# EAGLE schematic NFC_Demo_Board (EAGLE 9.2.2)
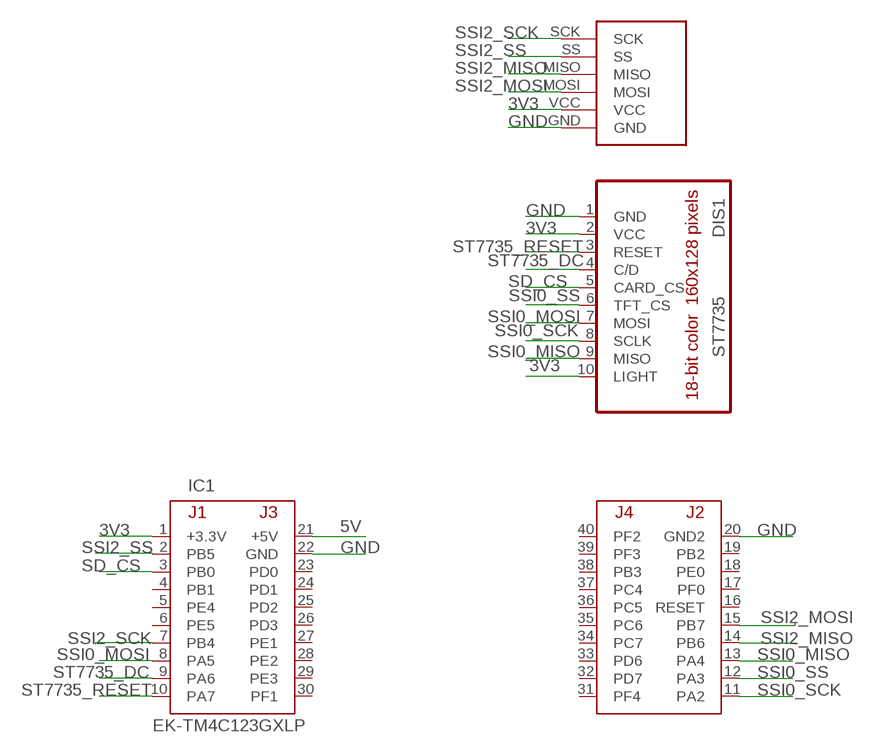
[diagram p0: schematic, sheet 1]

## Parts
DIS1  ST7735  [ST7735]
IC1  EK-TM4C123GXLP  [TM4C123LAUNCHPAD]
U$1  ELECHOUSE_PN532_SPI  [ELECHOUSE_PN532_SPI]

## Nets
3V3: DIS1.2(VCC) DIS1.10(LIGHT) IC1.1(+3.3V) U$1.VCC
5V: IC1.21(+5V)
GND: DIS1.1(GND) IC1.20(GND2) IC1.22(GND) U$1.GND
SD_CS: DIS1.5(CARD_CS) IC1.3(PB0)
SSI0_MISO: DIS1.9(MISO) IC1.13(PA4)
SSI0_MOSI: DIS1.7(MOSI) IC1.8(PA5)
SSI0_SCK: DIS1.8(SCLK) IC1.11(PA2)
SSI0_SS: DIS1.6(TFT_CS) IC1.12(PA3)
SSI2_MISO: IC1.14(PB6) U$1.MISO
SSI2_MOSI: IC1.15(PB7) U$1.MOSI
SSI2_SCK: IC1.7(PB4) U$1.SCK
SSI2_SS: IC1.2(PB5) U$1.SS
ST7735_DC: DIS1.4(C/D) IC1.9(PA6)
ST7735_RESET: DIS1.3(RESET) IC1.10(PA7)
Unconnected: IC1.4(PB1) IC1.5(PE4) IC1.6(PE5) IC1.16(RESET) IC1.17(PF0) IC1.18(PE0) IC1.19(PB2) IC1.23(PD0) IC1.24(PD1) IC1.25(PD2) IC1.26(PD3) IC1.27(PE1) IC1.28(PE2) IC1.29(PE3) IC1.30(PF1) IC1.31(PF4) IC1.32(PD7) IC1.33(PD6) IC1.34(PC7) IC1.35(PC6) IC1.36(PC5) IC1.37(PC4) IC1.38(PB3) IC1.39(PF3) IC1.40(PF2)

## Library data of the parts
DIS1 = UT_ECE:ST7735: Sitronix ST7735R 18-bit color, 1.8" TFT LCD display, 128*160, http://www.adafruit.com/products/358 // Backlight (pin 10) connected to +3.3 V // MISO (pin 9) PA4 (SSI0Rx) // SCK (pin 8) connected to PA2 (SSI0Clk) // MOSI (pin 7) connected to PA5 (SSI0Tx) // TFT_CS (pin 6) connected to PA3 (SSI0Fss) // CARD_CS (pin 5) connected to PD7 GPIO output(for SDC) // Data/Command (pin 4) connected to PA6 (GPIO), high for data, low for command // RESET (pin 3) connected to PA7 (GPIO) // VCC (pin 2) connected to +3.3 V // Gnd (pin 1) connected to ground; OC_FARNELL: unknown; OC_NEWARK: unknown
IC1 = UT_ECE:EK-TM4C123GXL: Texas Instruments TM4C123 LaunchPad EK-TM4C123GXL www.ti.com/tool/ek-tm4c123gxl
U$1 = Z:ELECHOUSE_PN532_SPI